# EAGLE design icbm_power_dpak (EAGLE 7.2.0)
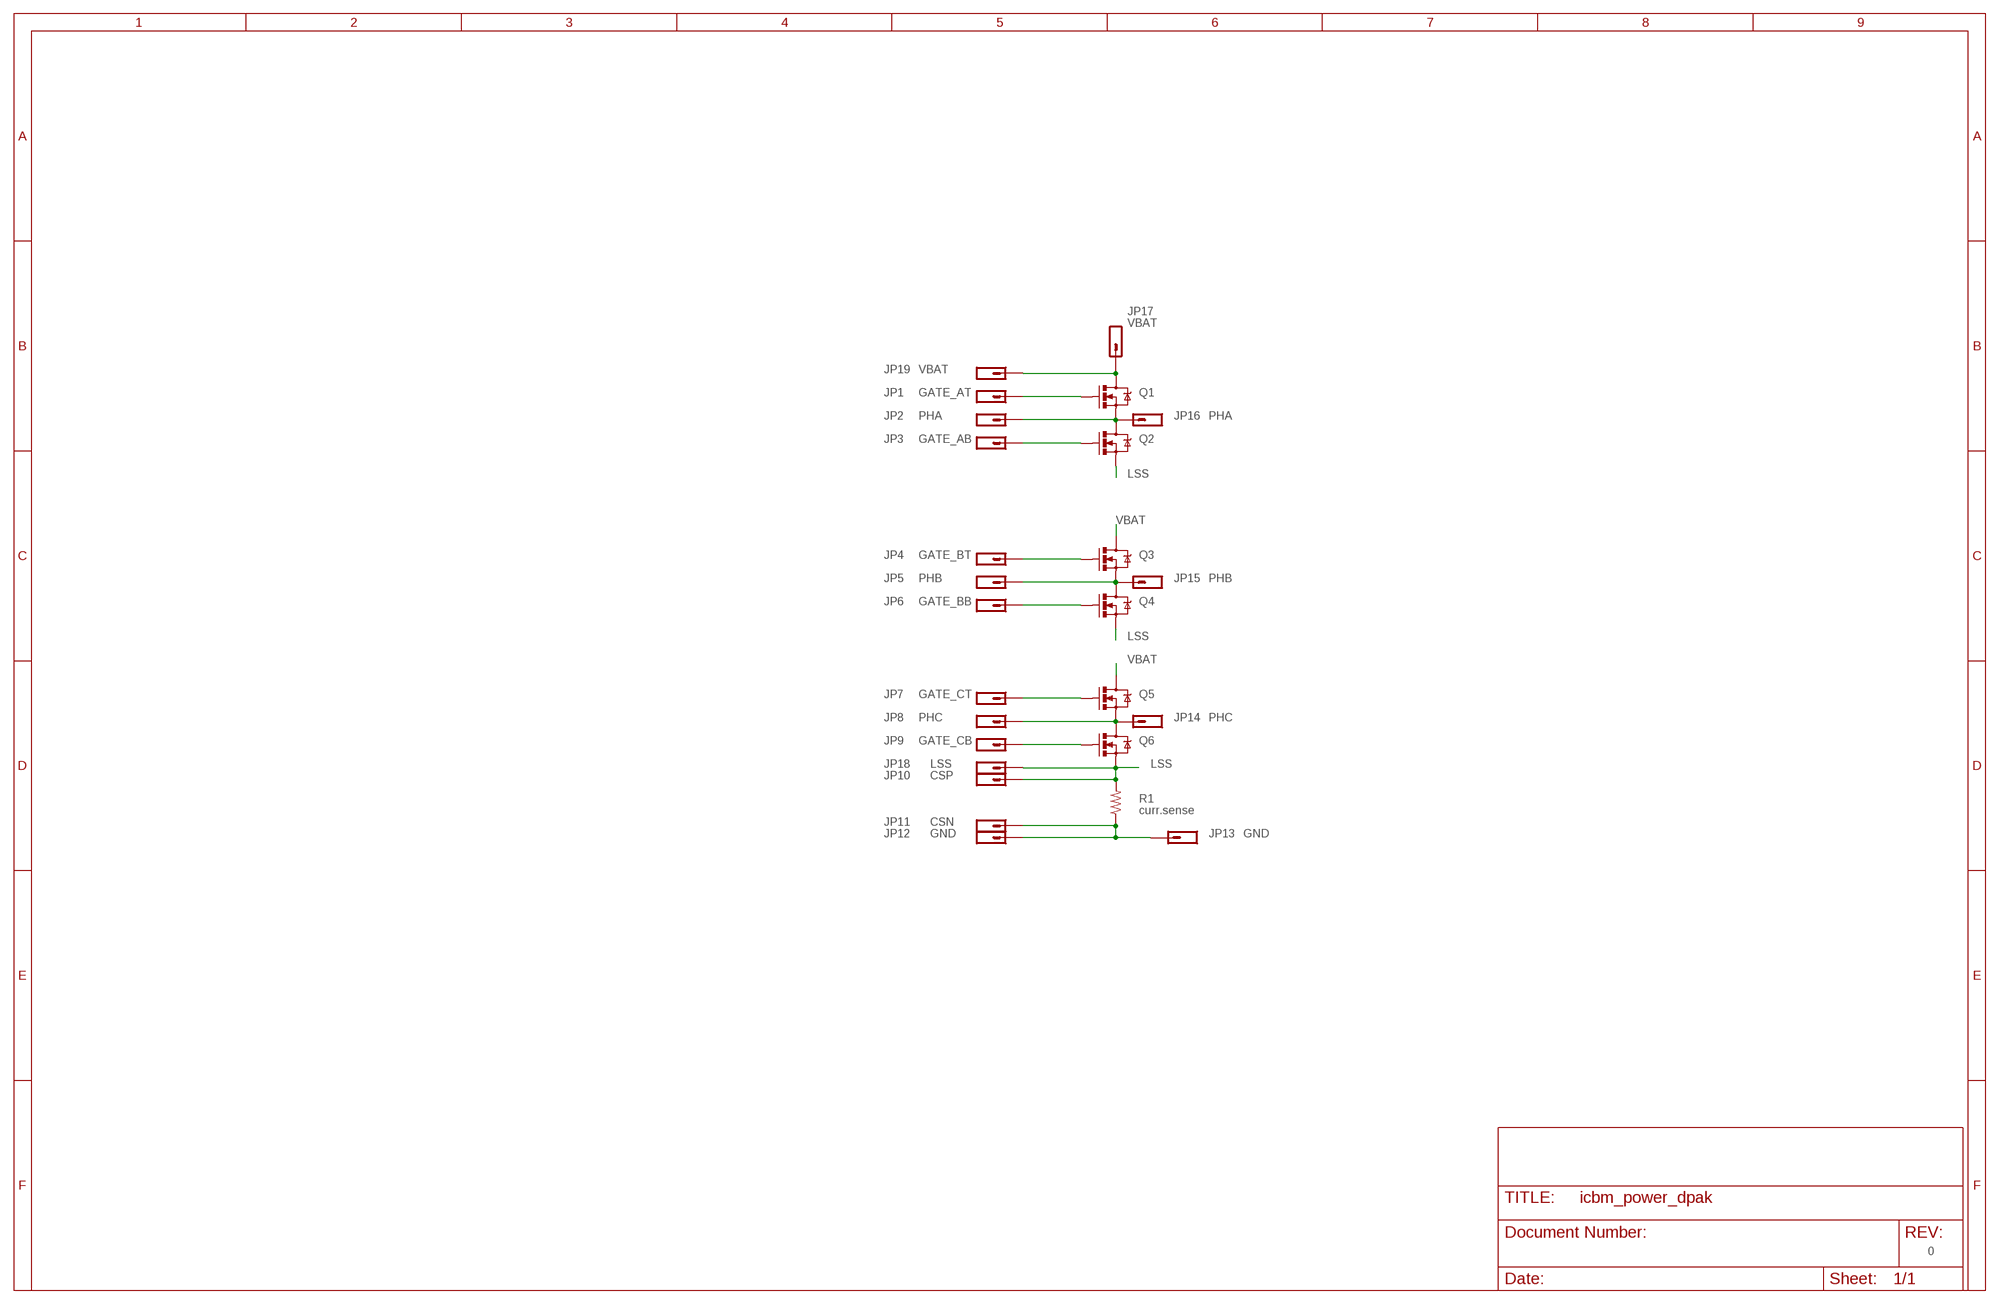
[diagram p0: schematic, sheet 1]

## Parts
JP1  GATE_AT  M01-TT  [1X01_TT]
JP2  PHA  M01-TT  [1X01_TT]
JP3  GATE_AB  M01-TT  [1X01_TT]
JP4  GATE_BT  M01-TT  [1X01_TT]
JP5  PHB  M01-TT  [1X01_TT]
JP6  GATE_BB  M01-TT  [1X01_TT]
JP7  GATE_CT  M01-TT  [1X01_TT]
JP8  PHC  M01-TT  [1X01_TT]
JP9  GATE_CB  M01-TT  [1X01_TT]
JP10  CSP  M01-TT  [1X01_TT]
JP11  CSN  M01-TT  [1X01_TT]
JP12  GND  M01-TT  [1X01_TT]
JP13  GND  M01-TT  [1X01_TT]
JP14  PHC  M01-TT  [1X01_TT]
JP15  PHB  M01-TT  [1X01_TT]
JP16  PHA  M01-TT  [1X01_TT]
JP17  VBAT  M01-TT  [1X01_TT]
JP18  LSS  M01-TT  [1X01_TT]
JP19  VBAT  M01-TT  [1X01_TT]
Q1  MOSFET-NCHANNEL-DPAK  [DPAK]
Q2  MOSFET-NCHANNEL-DPAK  [DPAK]
Q3  MOSFET-NCHANNEL-DPAK  [DPAK]
Q4  MOSFET-NCHANNEL-DPAK  [DPAK]
Q5  MOSFET-NCHANNEL-DPAK  [DPAK]
Q6  MOSFET-NCHANNEL-DPAK  [DPAK]
R1  curr.sense  RESISTOR-2512  [2512]

## Nets
GND: JP11.1 JP12.1 JP13.1 R1.P$1
LSS: JP10.1 JP18.1 Q2.3(S) Q4.3(S) Q6.3(S) R1.P$2
N$1: JP2.1 JP16.1 Q1.3(S) Q2.4(D)
N$2: JP5.1 JP15.1 Q3.3(S) Q4.4(D)
N$3: JP8.1 JP14.1 Q5.3(S) Q6.4(D)
N$4: JP1.1 Q1.1(G)
N$5: JP3.1 Q2.1(G)
N$10: JP4.1 Q3.1(G)
N$11: JP6.1 Q4.1(G)
N$14: JP7.1 Q5.1(G)
N$15: JP9.1 Q6.1(G)
VBAT: JP17.1 JP19.1 Q1.4(D) Q3.4(D) Q5.4(D)

## Notes on the sheet
- 0

## Library data of the parts
JP1-JP19 = ch_connectors:M01: Header 1 Standard 1-pin 0.1" header. Use with straight break away headers (SKU : PRT-00116), right angle break away headers (PRT-00553), swiss pins (PRT-00743), machine pins (PRT-00117), and female headers (PRT-00115).
Q1-Q6 = ch_generic:MOSFET-NCHANNEL: MOSFET-N
R1 = ch_passive:RESISTOR: Resistor Basic schematic elements and footprints for 0603, 1206, and PTH 1/10th watt (small) resistors.

## Board
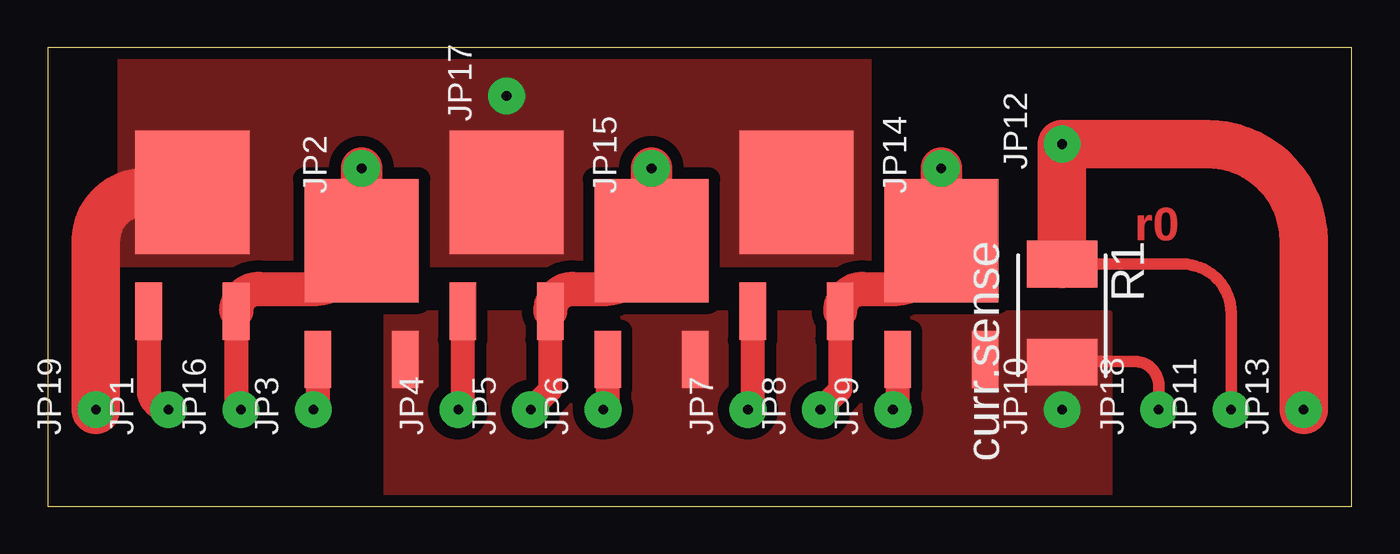
[diagram p1: board, top side]

Size 68.58 x 24.13 mm. Coordinates in mm from the lower left corner, seen from the top.
Outline: 68.58,0 68.58,24.11 0,24.13 0,0 68.58,0
Copper layers (1*16): Top 0.0356mm / dielectric 1.5011mm / Bottom 0.0356mm
Design rules "CH_TT": minimum track width 6mil, minimum drill 1mil, track to track 6mil, track to pad 6mil, pad to pad 6mil, via to via 6mil, smd to smd 6mil, copper to edge 15mil, drill to drill 6mil, minimum pad ring 7mil, minimum via ring 7mil, stop-mask expansion 4mil, vias tented up to drill 20mil, thermal gap 10mil

### Footprints (pad centres in the part's own frame; a part is rotated, then mirrored left to right if it is on the bottom)
1X01_TT = drill 0.508 pad 1.93: 1 0,0
DPAK = smd 1.4 x 3: 1 -2.3,-6.25; 3 2.3,-6.25 | smd 6 x 6.5: 4 0,0
2512 = smd 2.45 x 3.7: P$1 -2.58,0; P$2 2.58,0

### Placement (x,y rotation side)
JP1  6.35,5.08 90 top
JP2  16.51,17.78 90 top
JP3  13.97,5.08 90 top
JP4  21.59,5.08 90 top
JP5  25.4,5.08 90 top
JP6  29.21,5.08 90 top
JP7  36.83,5.08 90 top
JP8  40.64,5.08 90 top
JP9  44.45,5.08 90 top
JP10  53.34,5.08 90 top
JP11  62.23,5.08 90 top
JP12  53.34,19.05 90 top
JP13  66.04,5.08 90 top
JP14  46.99,17.78 90 top
JP15  31.75,17.78 90 top
JP16  10.16,5.08 90 top
JP17  24.13,21.59 90 top
JP18  58.42,5.08 90 top
JP19  2.54,5.08 90 top
Q1  7.62,16.51 0 top
Q2  16.51,13.97 0 top
Q3  24.13,16.51 0 top
Q4  31.75,13.97 0 top
Q5  39.37,16.51 0 top
Q6  46.99,13.97 0 top
R1  53.34,10.16 270 top

### Tracks (layer width: path | path; a pad name or v marks a point on that pad's centre or on a via)
GND
  Top 0.61: R1.P$1 59.65,12.74 arc-90 62.23,10.16 JP11.1
  Top 2.54: JP13.1 66.04,13.97 arc90 60.96,19.05 JP12.1 R1.P$1
LSS
  Top 0.61: JP18.1 58.42,6.35 arc90 57.15,7.62 53.38,7.62 R1.P$2
  pour Top (isolate 0.61, no thermals): 17.78,10.16 17.78,0 55.88,0 55.88,10.16
N$1
  Top 1.27: Q1.3 9.92,5.32 arc90 JP16.1
  Top 1.778: Q1.3 arc-90 11.09,11.43 13.97,11.43 arc90 Q2.4
  Top 2.184: Q2.4 JP2.1
N$2
  Top 1.27: Q3.3 26.43,6.11 JP5.1
  Top 1.778: Q3.3 arc-90 27.6,11.43 29.21,11.43 arc90 Q4.4
  Top 2.184: Q4.4 JP15.1
N$3
  Top 1.27: Q5.3 41.67,6.11 JP8.1
  Top 1.778: Q5.3 arc-90 42.84,11.43 44.45,11.43 arc90 Q6.4
  Top 2.184: Q6.4 JP14.1
N$4
  Top 1.27: Q1.1 5.32,6.11 arc90 JP1.1
N$5
  Top 1.27: Q2.1 14.21,5.32 JP3.1
N$10
  Top 1.27: Q3.1 21.83,5.32 JP4.1
N$11
  Top 1.27: Q4.1 29.45,5.32 JP6.1
N$14
  Top 1.27: Q5.1 37.07,5.32 JP7.1
N$15
  Top 1.27: Q6.1 44.69,5.32 JP9.1
VBAT
  Top 2.54: JP19.1 2.54,13.97 arc-90 5.08,16.51 Q1.4 arc90 7.62,15.24
  pour Top (isolate 0.61, no thermals): 3.81,12.7 3.81,24.13 43.18,24.13 43.18,12.7

### Text on the board
Top: r0